# EAGLE design board (EAGLE 6.3)

## Sheet 1 of 2
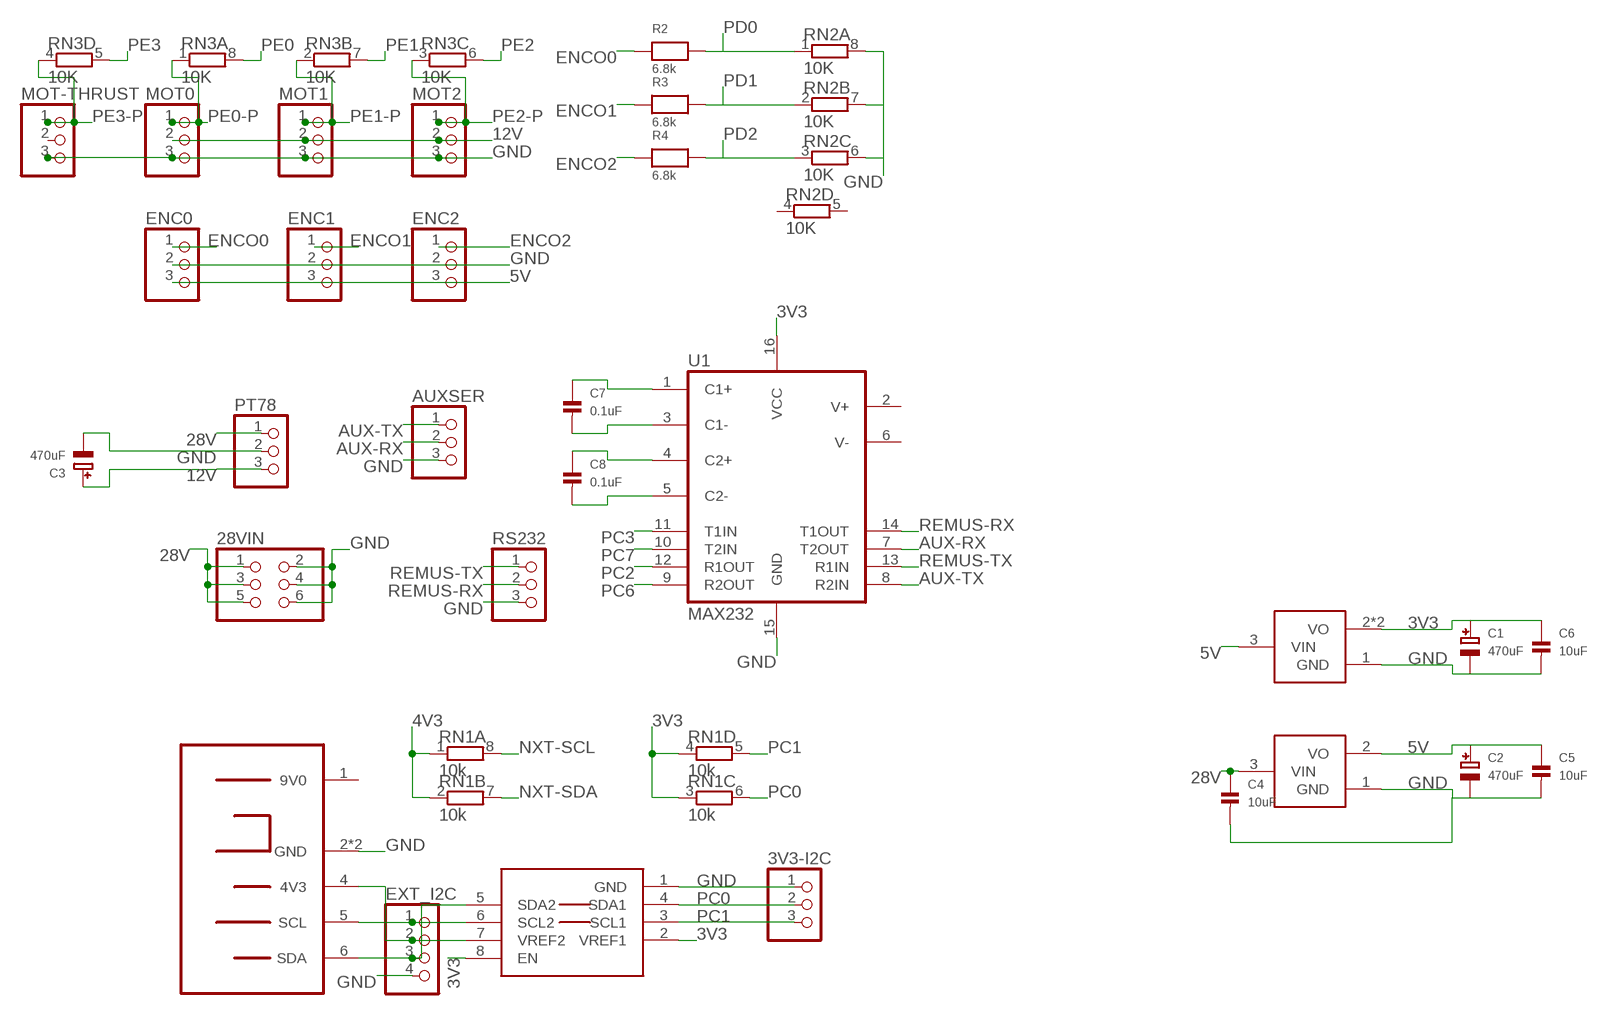
[diagram p0: schematic, sheet 1]

### Parts
3V3-I2C  HEADER-1X3ROUND  [1X03_ROUND]
28VIN  HEADER-2X3  [2X03]
AUXSER  HEADER-1X3ROUND  [1X03_ROUND]
C1  470uF  CAP_TANTALUMD/7343_WAVE  [EIA7343-31/D-W]
C2  470uF  CAP_TANTALUMD/7343_WAVE  [EIA7343-31/D-W]
C3  470uF  CAP_TANTALUMD/7343_WAVE  [EIA7343-31/D-W]
C4  10uF  CAP_CERAMIC1206  [1206]
C5  10uF  CAP_CERAMIC1206  [1206]
C6  10uF  CAP_CERAMIC1206  [1206]
C7  0.1uF  CAP_CERAMIC0603  [0603]
C8  0.1uF  CAP_CERAMIC0603  [0603]
ENC0  HEADER-1X3ROUND  [1X03_ROUND]
ENC1  HEADER-1X3ROUND  [1X03_ROUND]
ENC2  HEADER-1X3ROUND  [1X03_ROUND]
EXT_I2C  HEADER-1X4ROUND  [1X04_ROUND]
MOT0  HEADER-1X3ROUND  [1X03_ROUND]
MOT1  HEADER-1X3ROUND  [1X03_ROUND]
MOT2  HEADER-1X3ROUND  [1X03_ROUND]
MOT-THRUST  HEADER-1X3ROUND  [1X03_ROUND]
PT78  HEADER-1X3ROUND  [1X03_ROUND]
R2  6.8k  RESISTOR0603  [0603]
R3  6.8k  RESISTOR0603  [0603]
R4  6.8k  RESISTOR0603  [0603]
RN1  10k  RNETWORK  [RN8P-4R-CRA06S]
RN2  10K  RNETWORK  [RN8P-4R-CRA06S]
RN3  10K  RNETWORK  [RN8P-4R-CRA06S]
RS232  HEADER-1X3ROUND  [1X03_ROUND]
U1  MAX232  [SO-16]
U$1  PCA9306  [SO-08]
U$2  NXT-CONNECTOR  [NXT-FOOTPRINT]
U$3  VREGAP1117  [SOT223]
U$4  VREGIFX27001  [TO252]

### Nets
3V3: C1.+ C6.1 RN1.3 RN1.4 U1.16(VCC) U$1.2(VREF1) U$1.8(EN) U$3.2(VO) U$3.4(VO) ; also sheet 2
4V3: EXT_I2C.2 RN1.1 RN1.2 U$1.7(VREF2) U$2.4(4V3)
5V: C2.+ C5.1 ENC0.3 ENC1.3 ENC2.3 U$3.3(VIN) U$4.2(VO) ; also sheet 2
12V: C3.+ MOT0.2 MOT1.2 MOT2.2 PT78.3
28V: 28VIN.1 28VIN.3 28VIN.5 C4.1 PT78.1 U$4.3(VIN)
AUX-RX: AUXSER.2 U1.7(T2OUT)
AUX-TX: AUXSER.1 U1.8(R2IN)
C1+: C7.1 U1.1(C1+)
C1-: C7.2 U1.3(C1-)
C2+: C8.1 U1.4(C2+)
C2-: C8.2 U1.5(C2-)
ENCO0: ENC0.1 R2.1
ENCO1: ENC1.1 R3.1
ENCO2: ENC2.1 R4.1
GND: 3V3-I2C.1 28VIN.2 28VIN.4 28VIN.6 AUXSER.3 C1.- C3.- C4.2 C5.2 C6.2 ENC0.2 ENC1.2 ENC2.2 EXT_I2C.4 MOT0.3 MOT1.3 MOT2.3 MOT-THRUST.3 PT78.2 RN2.6 RN2.7 RN2.8 RS232.3 U1.15(GND) U$1.1(GND) U$2.2(GND) U$2.3(GND) U$3.1(GND) U$4.1(GND) ; also sheet 2
NXT-SCL: EXT_I2C.1 RN1.8 U$1.6(SCL2) U$2.5(SCL)
NXT-SDA: EXT_I2C.3 RN1.7 U$1.5(SDA2) U$2.6(SDA)
PC0: 3V3-I2C.2 RN1.6 U$1.4(SDA1) ; also sheet 2
PC1: 3V3-I2C.3 RN1.5 U$1.3(SCL1) ; also sheet 2
PC2: U1.12(R1OUT) ; also sheet 2
PC3: U1.11(T1IN) ; also sheet 2
PC6: U1.9(R2OUT) ; also sheet 2
PC7: U1.10(T2IN) ; also sheet 2
PD0: R2.2 RN2.1 ; also sheet 2
PD1: R3.2 RN2.2 ; also sheet 2
PD2: R4.2 RN2.3 ; also sheet 2
PE0: RN3.8 ; also sheet 2
PE0-P: MOT0.1 RN3.1
PE1: RN3.7 ; also sheet 2
PE1-P: MOT1.1 RN3.2
PE2: RN3.6 ; also sheet 2
PE2-P: MOT2.1 RN3.3
PE3: RN3.5 ; also sheet 2
PE3-P: MOT-THRUST.1 RN3.4
REMUS-RX: RS232.2 U1.14(T1OUT)
REMUS-TX: RS232.1 U1.13(R1IN)
Unconnected: C2.- MOT-THRUST.2 RN2.4 RN2.5 U1.2(V+) U1.6(V-) U$2.1(9V0)

## Sheet 2 of 2
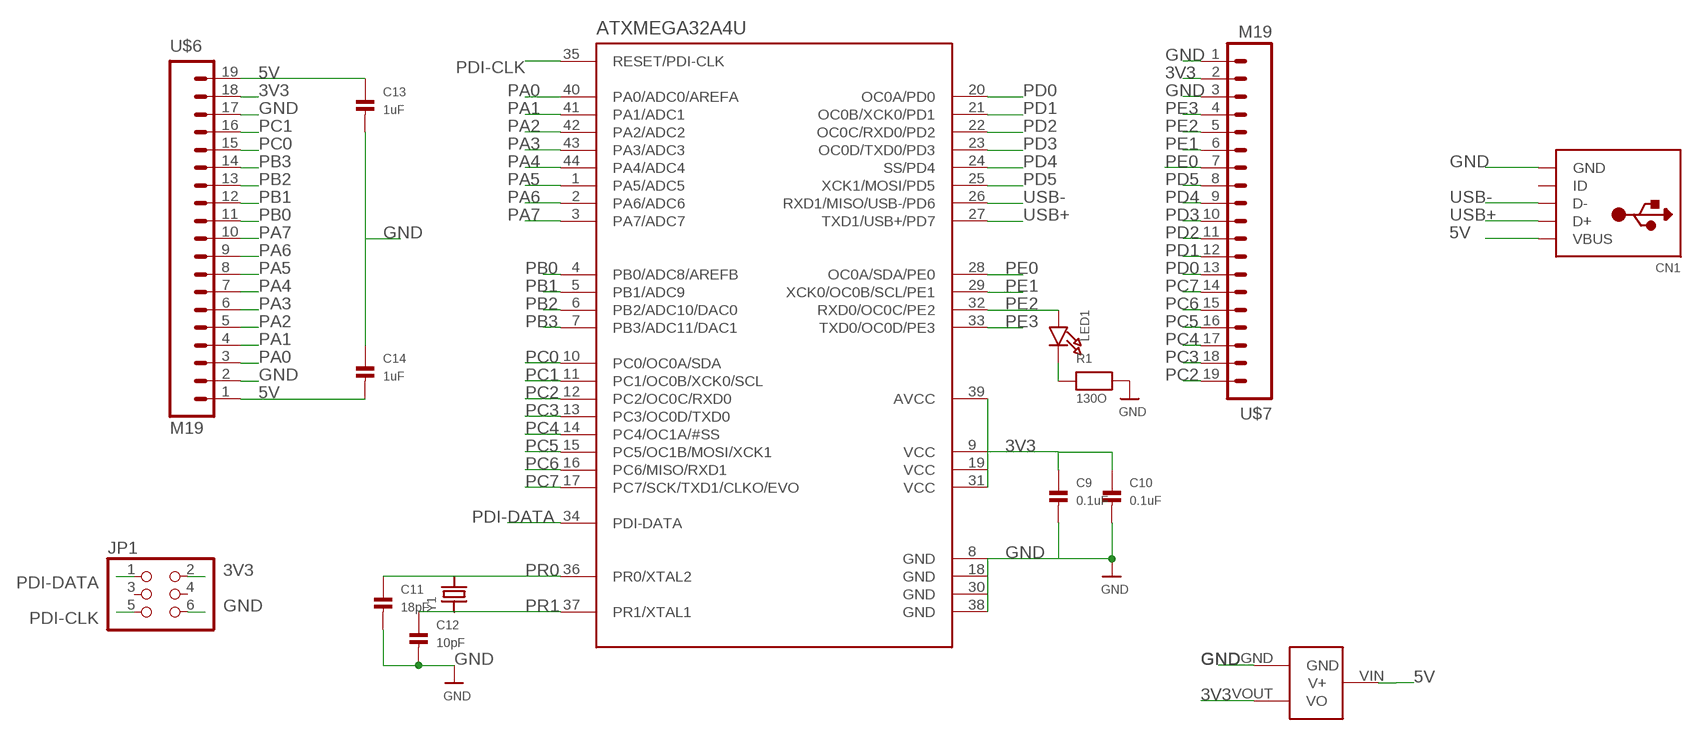
[diagram p1: schematic, sheet 2]

### Parts
ATXMEGA32A4U  ATXMEGAXXA4U-AU  [TQFP-44]
C9  0.1uF  CAP_CERAMIC0603  [0603]
C10  0.1uF  CAP_CERAMIC0603  [0603]
C11  18pF  CAP_CERAMIC0603  [0603]
C12  10pF  CAP_CERAMIC0603  [0603]
C13  1uF  CAP_CERAMIC0603  [0603]
C14  1uF  CAP_CERAMIC0603  [0603]
CN1  USBMICROB  [USB-MICROB]
JP1  HEADER-2X3  [2X03]
LED1  LED0603  [CHIPLED_0603]
R1  130O  RESISTOR0603  [0603]
U$5  MCP1700  [SOT23-3]
U$6  M19  [1X19]
U$7  M19  [1X19]
Y1  CRYSTAL  [NX8045GB]

### Nets
3V3: ATXMEGA32A4U.9(VCC) ATXMEGA32A4U.19(VCC) ATXMEGA32A4U.31(VCC) ATXMEGA32A4U.39(AVCC) C9.1 C10.1 JP1.2 U$5.VOUT(VO) U$6.18 U$7.2 ; also sheet 1
5V: C13.1 C14.2 CN1.P1(VBUS) U$5.VIN(V+) U$6.1 U$6.19 ; also sheet 1
GND: ATXMEGA32A4U.8(GND) ATXMEGA32A4U.18(GND) ATXMEGA32A4U.30(GND) ATXMEGA32A4U.38(GND) C9.2 C10.2 C11.2 C12.2 C13.2 C14.1 CN1.P5(GND) JP1.6 R1.2 U$5.GND U$6.2 U$6.17 U$7.1 U$7.3 ; also sheet 1
N$6: LED1.C R1.1
PA0: ATXMEGA32A4U.40(PA0/ADC0/AREFA) U$6.3
PA1: ATXMEGA32A4U.41(PA1/ADC1) U$6.4
PA2: ATXMEGA32A4U.42(PA2/ADC2) U$6.5
PA3: ATXMEGA32A4U.43(PA3/ADC3) U$6.6
PA4: ATXMEGA32A4U.44(PA4/ADC4) U$6.7
PA5: ATXMEGA32A4U.1(PA5/ADC5) U$6.8
PA6: ATXMEGA32A4U.2(PA6/ADC6) U$6.9
PA7: ATXMEGA32A4U.3(PA7/ADC7) U$6.10
PB0: ATXMEGA32A4U.4(PB0/ADC8/AREFB) U$6.11
PB1: ATXMEGA32A4U.5(PB1/ADC9) U$6.12
PB2: ATXMEGA32A4U.6(PB2/ADC10/DAC0) U$6.13
PB3: ATXMEGA32A4U.7(PB3/ADC11/DAC1) U$6.14
PC0: ATXMEGA32A4U.10(PC0/OC0A/SDA) U$6.15 ; also sheet 1
PC1: ATXMEGA32A4U.11(PC1/OC0B/XCK0/SCL) U$6.16 ; also sheet 1
PC2: ATXMEGA32A4U.12(PC2/OC0C/RXD0) U$7.19 ; also sheet 1
PC3: ATXMEGA32A4U.13(PC3/OC0D/TXD0) U$7.18 ; also sheet 1
PC4: ATXMEGA32A4U.14(PC4/OC1A/#SS) U$7.17
PC5: ATXMEGA32A4U.15(PC5/OC1B/MOSI/XCK1) U$7.16
PC6: ATXMEGA32A4U.16(PC6/MISO/RXD1) U$7.15 ; also sheet 1
PC7: ATXMEGA32A4U.17(PC7/SCK/TXD1/CLKO/EVO) U$7.14 ; also sheet 1
PD0: ATXMEGA32A4U.20(OC0A/PD0) U$7.13 ; also sheet 1
PD1: ATXMEGA32A4U.21(OC0B/XCK0/PD1) U$7.12 ; also sheet 1
PD2: ATXMEGA32A4U.22(OC0C/RXD0/PD2) U$7.11 ; also sheet 1
PD3: ATXMEGA32A4U.23(OC0D/TXD0/PD3) U$7.10
PD4: ATXMEGA32A4U.24(SS/PD4) U$7.9
PD5: ATXMEGA32A4U.25(XCK1/MOSI/PD5) U$7.8
PDI-CLK: ATXMEGA32A4U.35(RESET/PDI-CLK) JP1.5
PDI-DATA: ATXMEGA32A4U.34(PDI-DATA) JP1.1
PE0: ATXMEGA32A4U.28(OC0A/SDA/PE0) U$7.7 ; also sheet 1
PE1: ATXMEGA32A4U.29(XCK0/OC0B/SCL/PE1) U$7.6 ; also sheet 1
PE2: ATXMEGA32A4U.32(RXD0/OC0C/PE2) LED1.A U$7.5 ; also sheet 1
PE3: ATXMEGA32A4U.33(TXD0/OC0D/PE3) U$7.4 ; also sheet 1
PR0: ATXMEGA32A4U.36(PR0/XTAL2) C11.1 Y1.P$2
PR1: ATXMEGA32A4U.37(PR1/XTAL1) C12.1 Y1.P$1
USB+: ATXMEGA32A4U.27(TXD1/USB+/PD7) CN1.P3(D+)
USB-: ATXMEGA32A4U.26(RXD1/MISO/USB-/PD6) CN1.P2(D-)
Unconnected: CN1.P4(ID) JP1.3 JP1.4

## Library data of the parts
3V3-I2C AUXSER ENC0 ENC1 ENC2 MOT0 MOT1 MOT2 MOT-THRUST PT78 RS232 = nonolith:HEADER-1X3: PIN HEADER
28VIN JP1 = nonolith:HEADER-2X3: PIN HEADER
ATXMEGA32A4U = nonolith:ATXMEGAXXA4U: ATXMEGA A4U Series (XMEGA+USB)
C1-C3 = microbuilder:CAP_TANTALUM: Tantalum Capacitors Wave footprints have larger pads and are meant to be used for hand soldering. Reflow footprints are optimised for solder paste and a reflow oven. EIA3216-18/A-[R/W] - Size A / 3216-18 / 1206 footprint 4.7µF 25V 10% Tantalum Capacitor 10µF 16V 10% Tantalum Capacitor [Digikey: 495-2236-2-ND] EIA3528-21/B-[R/W] - Size B / 3528-21 47µF 10V 10% Tantalum Capactior [Digikey: 495-2216-1-ND] EIA6032-28/C-[R/W] - Size C / 6032-28 10µF 35V 20% Tantalum Capacitor [Digikey: 495-2285-1-ND] 100µF 16V 10% Tantalum Capactior [Digikey: 399-5214-1-ND]
C4-C14 = nonolith:CAP_CERAMIC: Ceramic Capacitors 0402 - 0402 Surface Mount Capacitors 0.1uF 10V 10% [Digikey: 490-1318-2-ND] 0603 - 0603 Surface Mount Capacitors 16 pF 50V 5% [Digikey: 445-5051-2-ND] 22 pF 50V [Digikey: PCC220ACVTR-ND] 33 pF 50V 5% [Digikey: 490-1415-1-ND] 56pF 50V 5% [Digikey: 490-1421-1-ND] 220pF 50V 5% [Digikey: 445-1285-1-ND] 680 pF 50V 2200 pF 50V 5% C0G [Digikey: 445-1297-1-ND] 5600 pF 100V 5% X7R [Digikey: 478-3711-1-ND] 0.1 µF 25V 10% [Digikey: PCC2277TR-ND] 0.22 µF 16V 10% X7R [Digikey: 445-1318-1-ND] 1.0 µF 25V 10% [Digikey: 445-5146-2-ND] 0603 - RF Specific 3pF 250V +/-0.1pF RF [Digikey: 712-1347-1-ND] 18 pF 250V 5% [Digikey: 478-3505-1-ND or 712-1322-1-ND] 56 pF 250V 5% C0G RF [Digikey: 490-4867-1-ND] 68 pF 250V RF [Digikey: 490-4868-1-ND] 0805 - 0805 Surface Mount Capacitors 220 pF 250V 2% RF Ceramic Capacitor [Digikey: 712-1398-1-ND] 1000 pF 50V 2% NP0 Ceramic Capacitor [Digikey: 478-3760-1-ND] 0.1 µF 25V 10% Ceramic Capacitor [Digikey: PCC1828TR-ND] 1.0 µF 16V 10% Ceramic Capacitor[Digikey: 490-1691-2-ND] 10.0 µF 10V 10% Ceramic Capacitor[Digikey: 709-1228-1-ND] 1206 - 1206 Surface Mount Capacitors
CN1 = nonolith:USB: USB Connectors USBMINIB - Surface Mount Female Mini-B USB Connector 4UConnector: 06564 By microbuilder.eu
EXT_I2C = nonolith:HEADER-1X4: PIN HEADER
LED1 = microbuilder:LED: LED 0603 - 0603 Surface Mount Package 2mA: Green LED - Low Power (3.9mcd, 2ma, 1.7Vf) - Digikey: 475-2709-2-ND Orange LED - Low Power (9.8mcd, 2ma, 1.8Vf) - Digikey: 475-1194-2-ND Red LED - Low Power (5mcd, 2ma, 1.8Vf) - Digikey: 475-1195-2-ND Yellow LED - Low Power (7mcd, 2ma, 1.8Vf) - Digikey: 475-1196-2-ND 5mA: Blue LED - Low Power (17mcd, 5ma, 2.9Vf) - Digikey: LNJ937W8CRACT-ND 0805 - 0805 Surface Mount Package 2mA: Red LED (8.8mcd, 2mA, 1.8Vf, Clear) - Low Power [Digikey: 475-2510-1-ND] Green LED (5mcd, 2mA, 1.8Vf, Clear) - Low Power [Digikey: 475-2730-1-ND] Yellow LED (11.3mcd, 2mA, 1.8Vf, Clear) - Low Power [Digikey: 475-2555-1-ND] 20mA: Red LED (104mcd, 20mA, Diffused) - LS R976 [Digikey: 475-1278-6-ND] Red LED (12mcd, 20mA, 2.0Vf, Clear) - APT2012EC [Digikey: 754-1128-1-ND] Green LED (15mcd, 20mA, 2.2Vf, Clear) - APT2012GC [Digikey: 754-1131-1-ND] Orange LED (160mcd, 20mA, 2.1Vf, Clear) - APT2012SECK [Digikey: 754-1130-1-ND] 1206 - 1206 Surface Mount Package Green LED (26mcd, 20mA, Diffused) - LG N971 [Digikey: 475-1407-6-ND] Red LED (15mcd, 20mA, Diffused) - LH N974 [Digikey: 475-1416-6-ND]
R1-R4 = nonolith:RESISTOR: Resistors 0402 - 0402 Surface Mount Package 10.0K 1% 1/16W [Digikey: 311-10.0KLRTR-ND] 0603 - 0603 Surface Mount Package 0 Ohm 1/10 Watt 1% Resistor 15 Ohm 1/10 Watt 1% Resistor 33 Ohm 1/10 Watt 1% Resistor 49.9 Ohm 1/10 Watt 1% Resistor 100 Ohm 1/10 Watt 1% Resistor 150 Ohm 1/10 Watt 1% Resistor 240 Ohm 1/10 Watt 1% Resistor 390 Ohm 1/10 Watt 1% Resistor 560 Ohm 1/10 Watt 1% Resistor 750 Ohm 1/10 Watt 1% Resistor 1.0K Ohm 1/10 Watt 1% Resistor 1.5K Ohm 1/10 Watt 1% Resistor 2.0K Ohm 1/10 Watt 1% Resistor 4.7K Ohm 1/10 Watt 1% Resistor 10.0K Ohm 1/10 Watt 1% Resistor 20.0K Ohm 1/10 Watt 1% Resistor 33.0K Ohm 1/10 Watt 1% Resistor 100.0K Ohm 1/10 Watt 1% Resistor 0805 - 0805 Surface Mount Package 0 Ohm 1/8 Watt 1% Resistor 33 Ohm 1/8 Watt 1% Resistor 100 Ohm 1/8 Watt 1% Resistor 150 Ohm 1/8 Watt 1% Resistor 200 Ohm 1/8 Watt 1% Resistor 240 Ohm 1/8 Watt 1% Resistor 330 Ohm 1/8 Watt 1% Resistor 390 Ohm 1/8 Watt 1% Resistor 470 Ohm 1/8 Watt 1% Resistor 1.0K Ohm 1/8 Watt 1% Resistor 1.5K Ohm 1/8 Watt 1% Resistor 2.0K Ohm 1/8 Watt 1% Resistor 4.7K Ohm 1/8 Watt 1% Resistor 5.1K Ohm 1/8 Watt 1% Resistor 5.6K Ohm 1/8 Watt 1% Resistor 10.0K Ohm 1/8 Watt 1% Resistor 22.0K Ohm 1/8 Watt 1% Resistor 33.0K Ohm 1/8 Watt 1% Resistor 100K Ohm 1/8 Watt 1% Resistor 1206 - 1206 Surface Mount Package
RN1-RN3 = nonolith:RNETWORK: 4 Resistor Array 0603
U1 = nonolith:MAX232: RS232 Transceiver SN75C3232 MAX[3]232
U$1 = nonolith:PCA9306: Bidirectional I2C level shifter. NOT compatible with all available part number pinout schemes- DOUBLE CHECK!!!
U$2 = nonolith:NXT-CONNECTOR
U$3 U$4 = nonolith:VREG
U$5 = nonolith:MCP1700: Voltage regulator
U$6 U$7 = SparkFun:M19
Y1 = nonolith:CRYSTAL: Crystals HC49UP - Surface Mount Crystal 4.0MHz 18pF +/-30ppm Surface Mount Crystal [Digikey: 535-9857-1-ND] 12.0 MHz Surface Mount Crystal [Digikey: 535-9869-6-ND] 25.0 MHz Surface Mount Crystal [Digikey: 535-9078-1-ND] 3.2 x 2.5mm - MEMs SMT Crystal 12.0 MHz 8pF 15ppm 3.2 x 2.5mm Crystal [Digikey: 644-1047-1-ND] 16.0 MHz 8pF 15ppm 3.2 x 2.5mm Crystal [Digikey: 644-1049-1-ND] 16.0 MHz 10pF 10ppm 3.2 x 2.5mm Crystal [Digikey: 644-1100-1-ND] 27.12 MHz 18pF 30ppm 3.2 x 2.5mm Crystal [Digikey: 887-1424-1-ND] 4.9 x 1.8mm - MEMs SMT Crystal 32.768 KHz 12.5pF 20ppm 4.9 x 1.8mm Crystal [Digikey: SE2415CT-ND] Cylinder 32.768KHz Cylinder Crystal

## Net classes
0 default: width 0.203 mm, clearance 0.152 mm

## Board
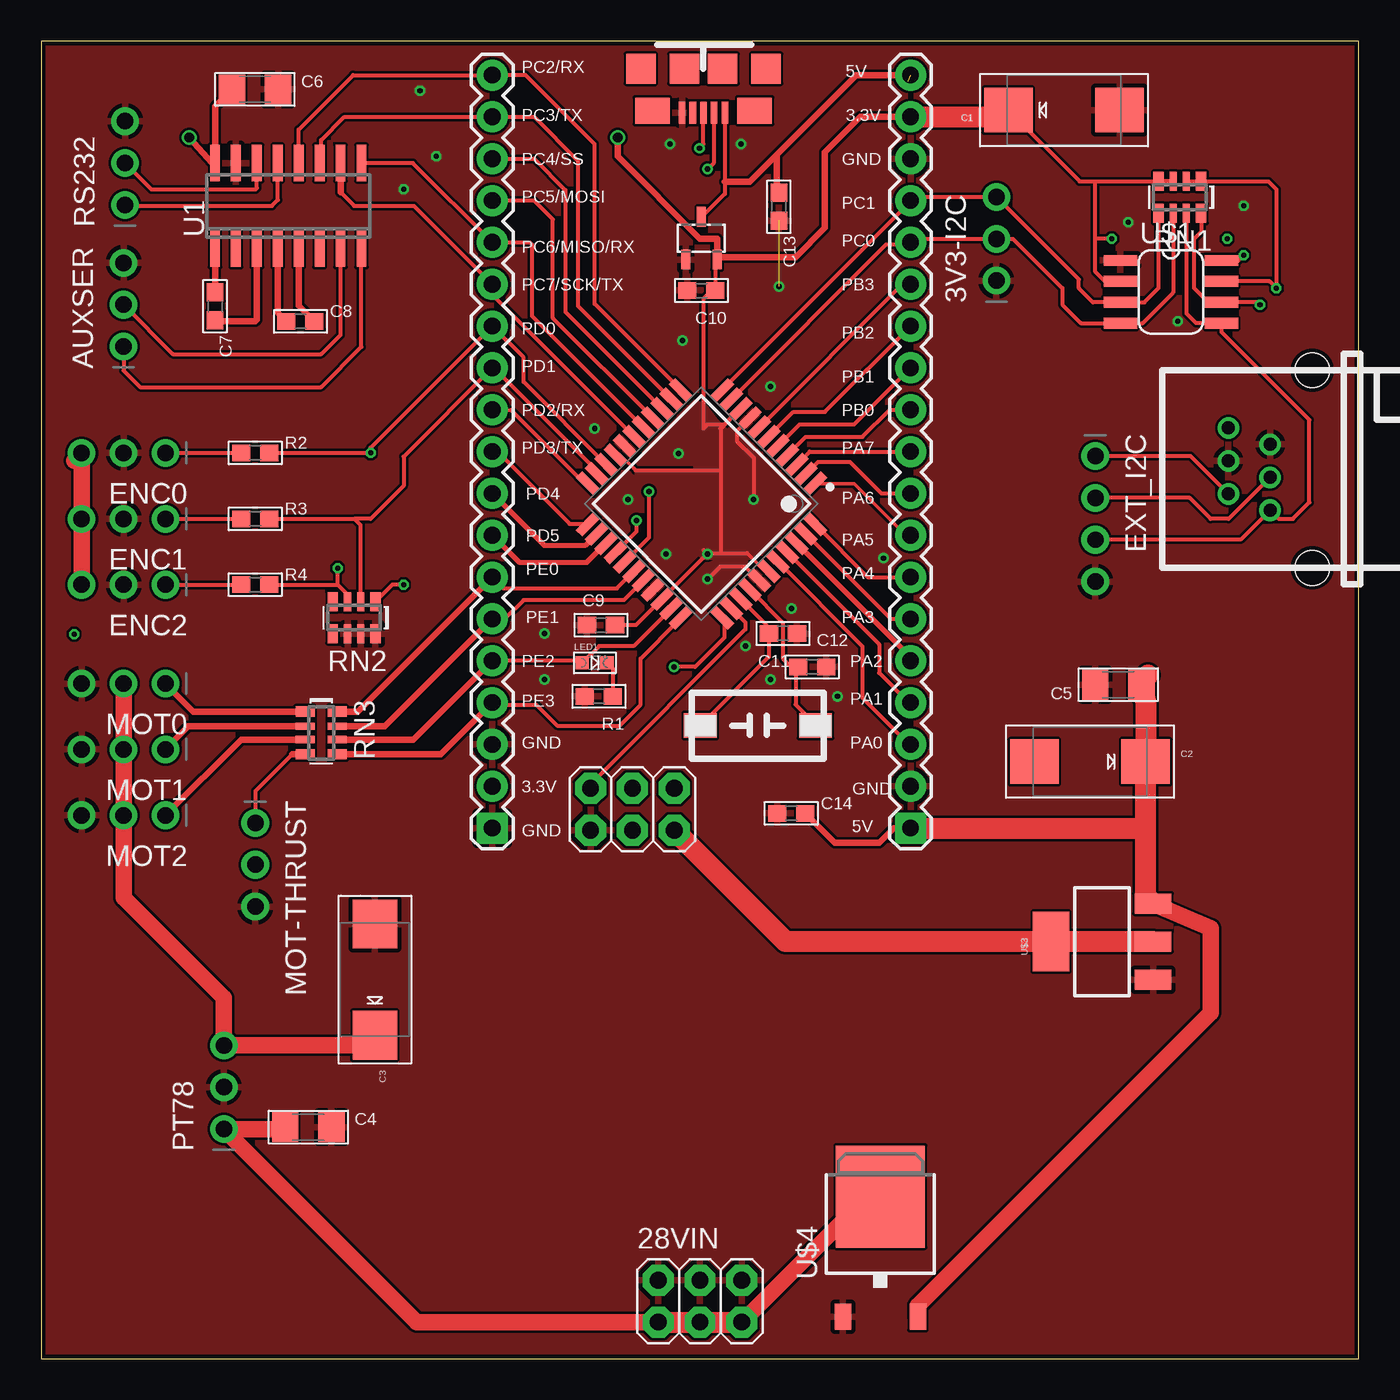
[diagram p2: board, top side]
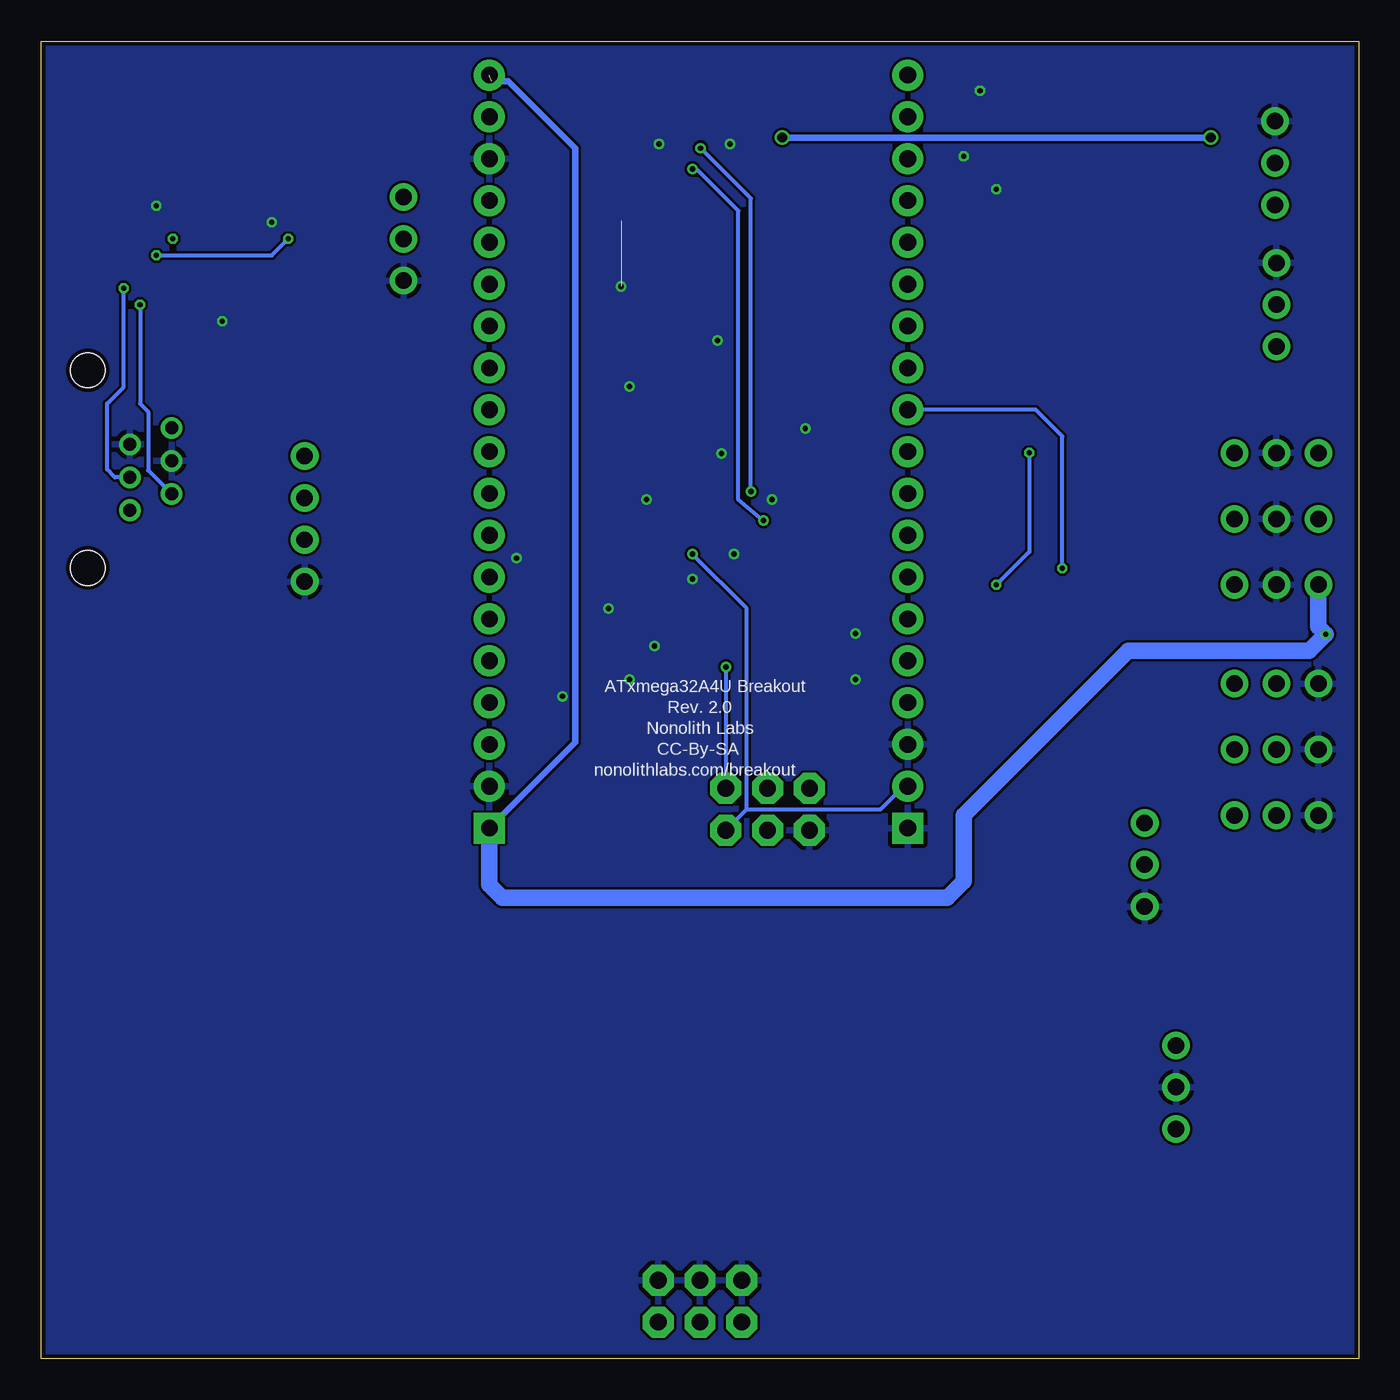
[diagram p3: board, bottom side, seen from below]

Size 80 x 80 mm. Coordinates in mm from the lower left corner, seen from the top.
Outline: 0,0 80,0 80,80 0,80 0,0
Copper layers (1*16): Top 0.035mm / dielectric 1.5mm / Bottom 0.035mm
Design rules "Fusion_eagle_rule_v1.1": minimum track width 6mil, minimum drill 12mil, track to track 6mil, track to pad 6mil, pad to pad 6mil, via to via 6mil, smd to smd 0mil, copper to edge 10mil, drill to drill 10mil, minimum pad ring 10mil, minimum via ring 6mil, stop-mask expansion 2mil, vias tented up to drill 100mil, thermal gap 10mil

### Footprints (pad centres in the part's own frame; a part is rotated, then mirrored left to right if it is on the bottom)
1X03_ROUND = drill 1 pad 1.676: 1 -2.54,0; 2 0,0; 3 2.54,0
2X03 = drill 1.016 pad 1.88 octagon: 1 -2.54,-1.27; 2 -2.54,1.27; 3 0,-1.27; 4 0,1.27; 5 2.54,-1.27; 6 2.54,1.27
TQFP-44 = smd 1.55 x 0.55: 1 -5.75,4; 2 -5.75,3.2; 3 -5.75,2.4; 4 -5.75,1.6; 5 -5.75,0.8; 6 -5.75,0; 7 -5.75,-0.8; 8 -5.75,-1.6; 9 -5.75,-2.4; 10 -5.75,-3.2; 11 -5.75,-4; 23 5.75,-4; 24 5.75,-3.2; 25 5.75,-2.4; 26 5.75,-1.6; 27 5.75,-0.8; 28 5.75,0; 29 5.75,0.8; 30 5.75,1.6; 31 5.75,2.4; 32 5.75,3.2; 33 5.75,4 | smd 0.55 x 1.55: 12 -4,-5.75; 13 -3.2,-5.75; 14 -2.4,-5.75; 15 -1.6,-5.75; 16 -0.8,-5.75; 17 0,-5.75; 18 0.8,-5.75; 19 1.6,-5.75; 20 2.4,-5.75; 21 3.2,-5.75; 22 4,-5.75; 34 4,5.75; 35 3.2,5.75; 36 2.4,5.75; 37 1.6,5.75; 38 0.8,5.75; 39 0,5.75; 40 -0.8,5.75; 41 -1.6,5.75; 42 -2.4,5.75; 43 -3.2,5.75; 44 -4,5.75
EIA7343-31/D-W = smd 2.95 x 2.7: + 3.375,0; - -3.375,0
1206 = smd 1.6 x 1.8: 1 -1.4,0; 2 1.4,0
0603 = smd 1.1 x 1: 1 -0.85,0; 2 0.85,0
USB-MICROB = smd 0.4 x 1.35: P1 -1.3,2.675; P2 -0.65,2.675; P3 0,2.675; P4 0.65,2.675; P5 1.3,2.675 | smd 1.8 x 1.8: PAD-LB -1.15,0; PAD-LLB -3.8,0; PAD-RB 1.15,0; PAD-RRB 3.8,0 | smd 2.1 x 1.6: PAD-LT -3.1,2.55; PAD-RT 3.1,2.55
1X04_ROUND = drill 1 pad 1.676: 1 -3.81,0; 2 -1.27,0; 3 1.27,0; 4 3.81,0
CHIPLED_0603 = smd 0.8 x 0.8: A 0,-0.75; C 0,0.75
RN8P-4R-CRA06S = smd 0.63 x 1.15: 1 -1.295,-0.975; 4 1.295,-0.975; 5 1.295,0.975; 8 -1.295,0.975 | smd 0.44 x 1.15: 2 -0.4,-0.975; 3 0.4,-0.975; 6 0.4,0.975; 7 -0.4,0.975
SO-16 = smd 0.6 x 2.2: 1 -4.445,-2.6; 2 -3.175,-2.6; 3 -1.905,-2.6; 4 -0.635,-2.6; 5 0.635,-2.6; 6 1.905,-2.6; 7 3.175,-2.6; 8 4.445,-2.6; 9 4.445,2.6; 10 3.175,2.6; 11 1.905,2.6; 12 0.635,2.6; 13 -0.635,2.6; 14 -1.905,2.6; 15 -3.175,2.6; 16 -4.445,2.6
SO-08 = smd 0.66 x 2.032: 1 -1.905,-3.073; 2 -0.635,-3.073; 3 0.635,-3.073; 4 1.905,-3.073; 5 1.905,3.073; 6 0.635,3.073; 7 -0.635,3.073; 8 -1.905,3.073
NXT-FOOTPRINT = drill 0.8: 1 -2.5,0; 2 -1.5,2.54; 3 -0.5,0; 4 0.5,2.54; 5 1.5,0; 6 2.5,2.54 | hole 2.1: -6,5.1; 6,5.1
SOT223 = smd 1.219 x 2.235: 1 -2.311,-3.099; 2 0,-3.099; 3 2.311,-3.099 | smd 3.6 x 2.2: 4 0,3.099
TO252 = smd 1 x 1.6: 1 -2.28,-4.8; 2 2.28,-4.8 | smd 5.4 x 6.2: 3 0,2.5
SOT23-3 = smd 0.55 x 1.2: GND 0.95,1.3; VIN 0,-1.3; VOUT -0.95,1.3
1X19 = drill 1.016 pad 1.88 square: 1 0,0 | drill 1.016 pad 1.88: 2 2.54,0; 3 5.08,0; 4 7.62,0; 5 10.16,0; 6 12.7,0; 7 15.24,0; 8 17.78,0; 9 20.32,0; 10 22.86,0; 11 25.4,0; 12 27.94,0; 13 30.48,0; 14 33.02,0; 15 35.56,0; 16 38.1,0; 17 40.64,0; 18 43.18,0; 19 45.72,0
NX8045GB = smd 2 x 1.5: P$1 -3.5,0; P$2 3.5,0

### Placement (x,y rotation side)
3V3-I2C  58,68 90 top
28VIN  40,3.5 0 top
ATXMEGA32A4U  40.09,51.91 225 top
AUXSER  5,64 90 top
C1  62.1,75.82 180 top
C2  63.68,36.26 0 top
C3  20.26,23.02 270 top
C4  16.22,14.07 0 top
C5  65.4,40.93 180 top
C6  12.98,77.07 0 top
C7  10.55,63.91 270 top
C8  15.74,62.99 0 top
C9  33.99,44.54 180 top
C10  40.09,64.86 180 top
C11  45.04,44.04 0 top
C12  46.82,42 0 top
C13  44.78,69.94 270 top
C14  45.55,33.11 0 top
CN1  40.21,78.33 180 top
ENC0  5,55 180 top
ENC1  5,51 180 top
ENC2  5,47 180 top
EXT_I2C  64,51 270 top
JP1  35.89,33.37 180 top
LED1  33.61,42.26 270 top
MOT0  5,41 180 top
MOT1  5,37 180 top
MOT2  5,33 180 top
MOT-THRUST  13,30 270 top
PT78  11.09,16.49 90 top
R1  33.86,40.23 180 top
R2  13,55 0 top
R3  13,51 0 top
R4  13,47 0 top
RN1  69.13,70.52 180 top
RN2  19,45 180 top
RN3  17,38 270 top
RS232  5.09,72.6 90 top
U1  15,70 0 top
U$1  68.59,64.78 270 top
U$2  72.08,54.02 270 top
U$3  64.41,25.33 90 top
U$4  50.95,7.35 0 top
U$5  40.09,68.04 180 top
U$6  52.78,32.23 90 top
U$7  27.39,32.23 90 top
Y1  43.51,38.45 180 top

### Tracks (layer width: path | path; a pad name or v marks a point on that pad's centre or on a via)
3V3  (via drill 0.3, 0.33, 0.6)
  Top 0.203: 42.85,48.91 43.92,47.85 44.12,47.85 ATXMEGA32A4U.39 | 40.97,65.12 41.02,65.17 | 36,54.04 35.23,54.81 34.93,54.81 ATXMEGA32A4U.19
  Top 0.254: 41.28,48.91 40.48,48.91 ATXMEGA32A4U.31 36.11,44.54 C9.1 34.62,44.54 | 41.28,48.91 42.85,48.91 | 41.28,48.91 41.28,53.94 | 41.28,53.94 41.28,56.53 | 36,54.04 36.1,53.94 41.28,53.94 | ATXMEGA32A4U.9 41.26,56.48 41.23,56.48 | 40.97,65.12 40.85,64.99 | 40.85,64.99 40.21,64.36 40.21,56.48 40.47,56.74 41.48,56.74 42.5,57.75 | U$5.VOUT 40.94,66.64 C10.1 40.85,64.95 40.85,64.99 | 49.7,75.41 U$6.18 | v40.47,48.86 40.21,49.12 | RN1.3 RN1.4 64,71.5 | C1.+ 63.05,71.5 64,71.5 | U$1.2 64.58,65.42 64,66 64,68 | 64,68 64,71.5 | U$1.8 72.69,66.69 v73,67 | v65,68 64,68
  Top 0.406: U$6.18 49.74,75.41 47.58,73.25 47.58,68.67 45.8,66.9 41.19,66.9 U$5.VOUT 41.03,68 40,68 35,73 v35,74.15 | C6.1 10.55,76.05 U1.16 10.4,72.6 v9,74.15
  Top 1.27: U$3.2 U$3.4 45.2,25.33 JP1.2 | U$6.18 58.31,75.41 C1.+
  Bottom 0.254: JP1.2 37.16,33.37 | 37.16,33.37 29.04,33.37 27.64,34.77 U$7.2 | 37.16,33.37 37.16,45.56 v40.47,48.86 | v73,67 66,67 v65,68
  Bottom 0.406: v9,74.15 v35,74.15
  pour Top: 40.21,58.01 40.97,56.99 41.74,56.23 41.74,50.39 43.26,48.86 43.01,48.61 40.21,48.61 37.16,51.66 37.16,52.42 36.15,53.43 36.15,53.94 39.7,53.94 39.7,58.01
4V3  (via drill 0.3)
  Top 0.254: U$1.7 74.58,65.42 v75,65 75,71 74.5,71.5 RN1.1 RN1.2 | U$2.4 72.1,51 71,51 69.73,52.27 EXT_I2C.2
  Bottom 0.254: U$2.4 75.52,53.52 76,54 76,58 75,59 v75,65
5V  (via drill 0.3)  (1 unrouted)
  Top 0.254: CN1.P1 41.51,71.47 41.51,70.74 40.21,69.44 | 40.21,69.44 39.96,69.18 | U$5.VIN 40.18,69.44 40.21,69.44
  Top 0.406: U$6.19 49.48,77.94 44.66,73.12 | 44.66,73.12 43.01,71.47 41.51,71.47 | C13.1 44.66,70.92 44.66,73.12 | C14.2 48.17,31.34 50.88,31.34 51.77,32.23 U$6.1
  Top 1: ENC2.3 ENC1.3 ENC0.3 2,54.54 | U$4.2 53.23,3.23 71,21 71,26.15 U$3.3
  Top 1.27: 67.2,41.52 C5.1 67.06,39.92 C2.+ 67.06,32 | U$3.3 67.06,28.09 67.06,32 | U$6.1 66.83,32.23 67.06,32
  Bottom 0.406: U$6.1 47.58,37.43 47.58,73.5 51.64,77.56 52.66,77.56
  Bottom 1: U$6.1 52.78,28.79 52,28 25,28 24,29 24,33 14,43 3,43 v2,44 2.46,44.46 ENC2.3
12V
  Top 1: MOT0.2 MOT1.2 MOT2.2 5,28 11.09,21.91 PT78.3 19.64,19.03 C3.+
28V
  Top 1: U$4.3 50.16,9.85 28VIN.5 | 28VIN.1 22.81,2.23 PT78.1 14.7,13.95 C4.1
  Top 1.27: 28VIN.1 28VIN.3 28VIN.5
AUX-RX
  Top 0.254: AUXSER.2 8,61 17,61 18.18,62.17 U1.7
AUX-TX
  Top 0.254: AUXSER.1 5,60 6,59 17,59 19.45,61.45 U1.8
C1+
  Top 0.406: U1.1 C7.1
C1-
  Top 0.406: U1.3 13.1,63.09 13,63 11.05,63 C7.2
C2+
  Top 0.406: U1.4 14.37,63.52 C8.1
C2-
  Top 0.406: U1.5 15.63,63.95 C8.2
ENCO0
  Top 0.254: ENC0.1 R2.1
ENCO1
  Top 0.254: ENC1.1 R3.1
ENCO2
  Top 0.254: ENC2.1 R4.1
GND  (via drill 0.3, 0.33)  (1 unrouted)
  Top 0.254: ATXMEGA32A4U.8 42.24,56.33 42.24,55.72 43.26,54.7 v43.26,52.16 | 43.51,47.34 42.75,48.1 41.23,48.1 v40.47,47.34
  other vias: 48.34,40.23 45.55,45.56 37.93,48.86 44.78,65.12 38.18,73.75 33.61,56.48 35.64,52.16 30.56,41.24 42.5,73.75 42.75,43.27 44.28,41.24 51.13,48.61 44.28,59.02 38.69,54.96 38.94,61.82 30.56,44.04 73,70 66,69 69,63 23,77 24,73 22,71
  pour Top: -18,89 -6,89 -6,97 95,97 95,-20 -18,-20
  pour Bottom: -11,93 90,93 90,-17 -13,-17 -13,90 -13,91 -11,91
N$4  (via drill 0.3)
  other vias: 72,68
N$6
  Top 0.254: LED1.C 34.71,41.9 R1.1
NXT-SCL  (via drill 0.3)
  Top 0.254: RN1.8 70.42,68.42 70,68 70,65 70.86,64.14 U$1.6 73.86,64.14 v74,64 | U$2.5 69.79,54.81 EXT_I2C.1
  Bottom 0.254: v74,64 74,58 73.5,57.5 73.5,53.94 U$2.5
NXT-SDA
  Top 0.254: RN1.7 69.53,63.47 70.12,62.88 U$1.5 71.66,62.34 77,57 77,52 76,51 75.14,51 U$2.6 72.83,49.73 EXT_I2C.3
PA0
  Top 0.203: 52.66,37.33 52.76,37.33 U$6.3 | 44.73,48.41 ATXMEGA32A4U.40
  Top 0.254: 52.66,37.33 49.86,40.12 49.86,43.26 ATXMEGA32A4U.40
PA1
  Top 0.203: 52.66,39.87 52.76,39.87 U$6.4 | ATXMEGA32A4U.41 45.29,48.96
  Top 0.254: 52.66,39.87 50.88,41.65 50.88,43.38 ATXMEGA32A4U.41
PA2
  Top 0.305: ATXMEGA32A4U.42 52.78,42.6 U$6.5
PA3
  Top 0.203: 52.76,44.95 U$6.6
  Top 0.254: ATXMEGA32A4U.43 51.59,44.92 U$6.6
PA4
  Top 0.203: ATXMEGA32A4U.44 47.02,50.64
  Top 0.254: 47.02,50.64 50.19,47.47 U$6.7
PA5
  Top 0.203: ATXMEGA32A4U.1 47.02,53.13 49.36,53.13 52.45,50.03 52.76,50.03 U$6.8
PA6
  Top 0.203: ATXMEGA32A4U.2 46.46,53.74
  Top 0.254: 46.46,53.74 47.17,54.45 49.1,54.45 51.01,52.55 U$6.9
PA7
  Top 0.254: ATXMEGA32A4U.3 46.65,55.09 U$6.10
PB0
  Top 0.254: ATXMEGA32A4U.4 46.41,55.97 49.86,55.97 51.52,57.62 U$6.11
PB1
  Top 0.254: ATXMEGA32A4U.5 46.04,56.74 49.36,56.74 U$6.12
PB2
  Top 0.254: ATXMEGA32A4U.6 45.67,57.5 47.58,57.5 U$6.13
PB3
  Top 0.254: ATXMEGA32A4U.7 52.29,65.25 U$6.14
PC0
  Top 0.254: ATXMEGA32A4U.10 51.31,67.66 52.91,67.66 | 52.91,67.66 U$6.15 | 52.91,67.66 53.25,68 3V3-I2C.2 59,68 62,65 62,64 63.12,62.88 U$1.4 66.88,62.88 68.73,64.73 RN1.6
PC1
  Top 0.254: ATXMEGA32A4U.11 52.78,70.27 U$6.16 53,70.54 3V3-I2C.3 63,65.54 63,65 63.85,64.14 U$1.3 66.98,64.14 67.83,65 RN1.5
PC2
  Top 0.254: ATXMEGA32A4U.12 33.61,64.04 33.61,73.75 29.42,77.94 U$7.19 18.95,77.94 15.63,74.64 U1.12
PC3
  Top 0.254: ATXMEGA32A4U.13 32.59,63.93 32.59,72.74 29.93,75.41 U$7.18 18.41,75.41 17,74 17,72.69
  Top 0.406: U1.11 17,72.69
PC4
  Top 0.254: U$7.17 29.93,72.86 31.83,70.96 31.83,63.56 ATXMEGA32A4U.14
PC5
  Top 0.254: ATXMEGA32A4U.15 31.07,63.19 31.07,69.18 29.93,70.33 U$7.16
PC6
  Top 0.254: ATXMEGA32A4U.16 29.8,63.33 29.8,67.66 29.67,67.78 U$7.15 22.57,72.6 U1.9
PC7
  Top 0.254: ATXMEGA32A4U.17 27.39,64.61 U$7.14 22.63,70 19,70 18.18,70.83
  Top 0.406: U1.10 18.18,70.83
PD0  (via drill 0.3)
  Top 0.254: ATXMEGA32A4U.20 29.29,59.31 29.29,60.8 U$7.13 20,55.32 v20,55 R2.2 | v22,47 21.32,47 RN2.1
  Bottom 0.254: v20,55 20,49 v22,47
PD1
  Top 0.203: 33.71,53.94 33.71,53.74 ATXMEGA32A4U.21 | 27.51,60.14 27.41,60.14 U$7.12
  Top 0.254: 27.51,60.14 33.71,53.94 | R3.2 19,51 | 19,51 19.4,50.6 RN2.2 | U$7.12 22,54.78 22,53 20,51 19,51
PD2  (via drill 0.3)
  Top 0.203: 32.95,53.18 33.15,53.18 ATXMEGA32A4U.22 | 28.53,57.6 27.41,57.6 U$7.11
  Top 0.254: 28.53,57.6 32.95,53.18 | R4.2 18,47 | RN2.3 18.6,46.4 18,47 | 18,47 v18,48
  Bottom 0.254: v18,48 18,56 19.62,57.62 U$7.11
PD3
  Top 0.203: 27.71,55.06 27.41,55.06 U$7.10 | 33.15,50.69 ATXMEGA32A4U.23
  Top 0.254: 33.15,50.69 32.08,50.69 27.71,55.06
PD4
  Top 0.305: ATXMEGA32A4U.24 33.02,49.37 30.56,49.37 U$7.9
PD5
  Top 0.305: U$7.8 29.04,48.35 33.13,48.35 ATXMEGA32A4U.25
PDI-CLK
  Top 0.254: ATXMEGA32A4U.35 42.75,44.72 42.75,44.29 33.35,34.89 JP1.5
PDI-DATA  (via drill 0.33)
  Top 0.254: ATXMEGA32A4U.34 41.48,44.86 41.48,43.78 39.7,42 v38.43,42
  Bottom 0.254: v38.43,42 JP1.1
PE0
  Top 0.203: 36,47.8 ATXMEGA32A4U.28
  Top 0.254: U$7.7 28.07,46.78 34.95,46.78 ATXMEGA32A4U.28
  Top 0.406: U$7.7 19.21,39.3 RN3.8
PE0-P
  Top 0.406: RN3.1 9.24,39.3 MOT0.1
PE1
  Top 0.254: ATXMEGA32A4U.29 35.37,46.07 29.29,46.07 28.15,44.92 U$7.6
  Top 0.406: U$7.6 20.86,38.4 RN3.7
PE1-P
  Top 0.406: RN3.2 8.94,38.4 MOT1.1
PE2
  Top 0.254: ATXMEGA32A4U.32 35.97,43.27 33.87,43.27 LED1.A 32.98,42.38 U$7.5
  Top 0.406: U$7.5 22.6,37.6 RN3.6
PE2-P
  Top 0.406: RN3.3 12.14,37.6 MOT2.1
PE3
  Top 0.254: U$7.4 27.51,39.72 30.05,39.72 31.32,38.45 35.13,38.45 36.4,39.72 36.4,42.51 38.69,44.8 38.69,45.05 38.72,45.02 ATXMEGA32A4U.33 38.85,44.96
  Top 0.406: U$7.4 24.25,36.7 RN3.5
PE3-P
  Top 0.254: 15.24,36.7 13,34.46 MOT-THRUST.1
  Top 0.406: RN3.4 15.24,36.7
PR0
  Top 0.254: ATXMEGA32A4U.36 44.02,44.58 44.02,44.04 | 44.02,44.04 44.02,43.78 44.28,44.04 C11.1 | C11.1 44.19,42.62 Y1.P$2 | C11.1 44.02,44.04 | 44.02,44.04 44.28,44.29 44.28,44.12 C11.1
PR1
  Top 0.254: ATXMEGA32A4U.37 45.04,44.69 45.04,42.51 45.8,41.75 | 45.8,41.75 C12.1 | 45.8,41.75 45.8,39.72 47.07,38.45 Y1.P$1
REMUS-RX
  Top 0.254: RS232.2 6.69,71 13,71 13.1,71.09 U1.14
REMUS-TX
  Top 0.254: RS232.1 5.15,70 14,70 14.37,70.36 U1.13
USB+  (via drill 0.33)
  Top 0.254: ATXMEGA32A4U.27 36.91,49.87 v36.91,52.67 | v39.96,73.5 40.21,73.75 CN1.P3
  Bottom 0.254: v36.91,52.67 36.91,70.45 v39.96,73.5
USB-  (via drill 0.33)
  Top 0.254: ATXMEGA32A4U.26 36.15,50.24 v36.15,50.89 | v40.47,72.23 40.86,72.63 CN1.P2
  Bottom 0.254: v36.15,50.89 37.67,52.16 37.67,69.69 40.21,72.23 v40.47,72.23

### Text on the board
tNames: PC2/RX | 5V | PC3/TX | 3.3V | PC4/SS | GND | PC5/MOSI | PC1 | PC0 | PC6/MISO/RX | PC7/SCK/TX | PB3 | PD0 | PB2 | PD1 | PB1 | PD2/RX | PB0 | PD3/TX | PA7 | PD4 | PA6 | PD5 | PA5 | PE0 | PA4 | PE1 | PA3 | PE2 | PA2 | PE3 | PA1 | GND | PA0 | 3.3V | GND | GND | 5V
bNames: ATxmega32A4U Breakout | Rev. 2.0 | Nonolith Labs | CC-By-SA | nonolithlabs.com/breakout